# Altium project Back_Expansion_Joystick_8p_16_5mm_15_5mm.PrjPcb
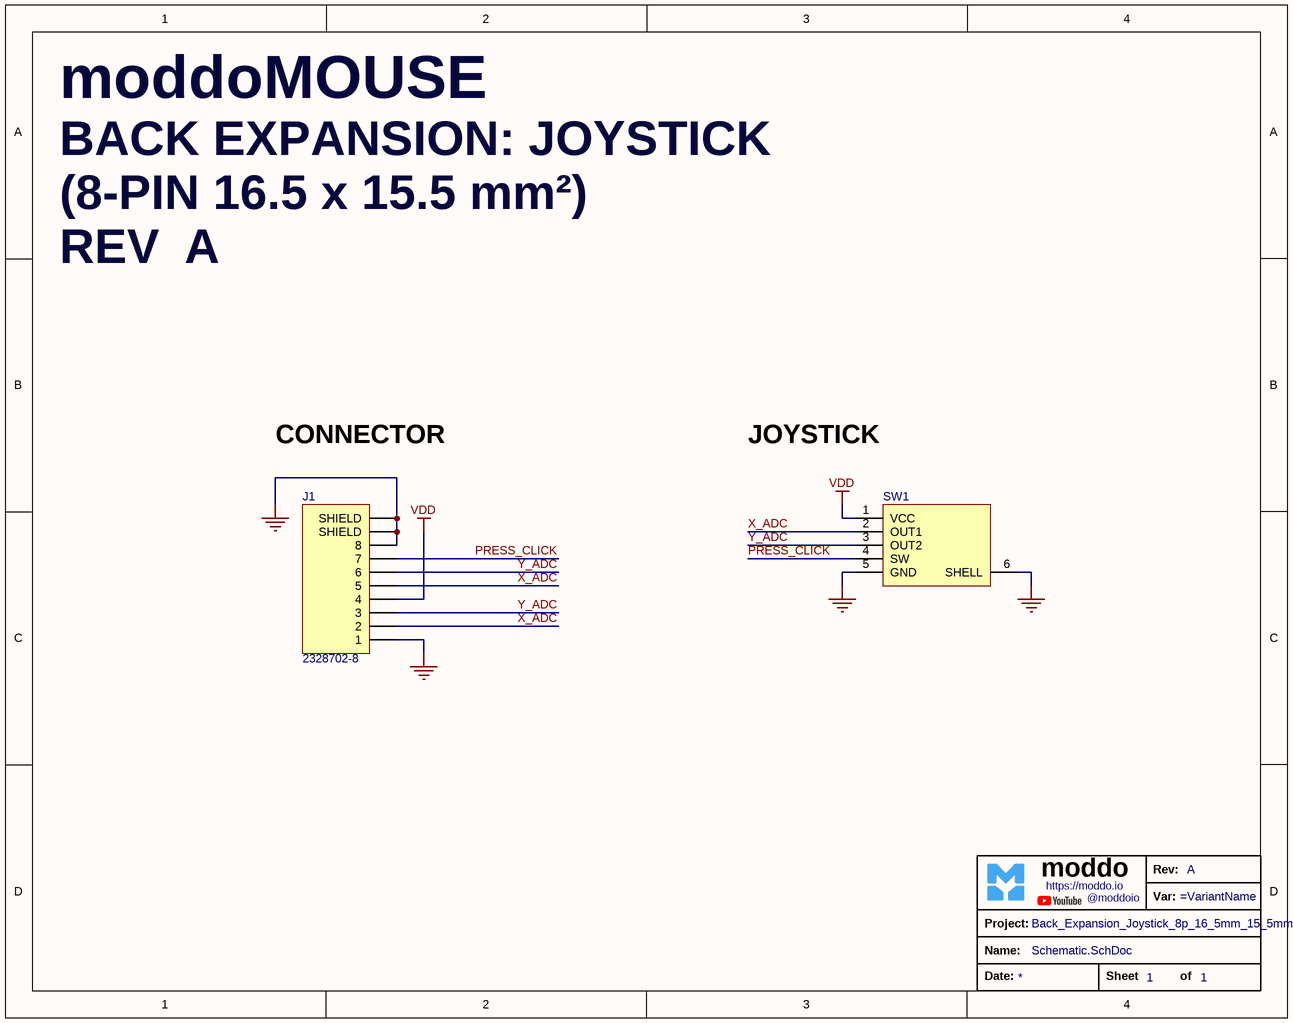
[diagram p0: Schematic.SchDoc]
Revision: A
1 sheet, 3 parts. Net scope: global (net labels, ports and power ports of the same name join across sheets).
Board files: PCB.PcbDoc, PcbPanel.PcbDoc

## Sheet Schematic.SchDoc
size A; SheetNumber: 1; SheetTotal: 1

### Parts
?  TitleBlock_moddo  (value not drawn)  (graphical)
J1  2328702-8  [2328702-8]
SW1  YHE-YG16-001 SH1B166A1  [Joystick_8p_16_5mm_15_5mm]  (value not drawn)

### Nets
GND: J1.1 J1.8 J1.S1(SHIELD) J1.S2(SHIELD) SW1.5(GND) SW1.6(SHELL)
VDD: J1.4 SW1.1(VCC)
PRESS_CLICK: J1.7 SW1.4(SW)
X_ADC: J1.2 J1.5 SW1.2(OUT1)
Y_ADC: J1.3 J1.6 SW1.3(OUT2)

### Notes on the sheet
- moddoMOUSE <https://moddo.io/>
- BACK EXPANSION: JOYSTICK <https://moddo.io/>
- (8-PIN 16.5 x 15.5 mm²) <https://moddo.io/>
- REV
- CONNECTOR
- JOYSTICK
- (in symbol TitleBlock_moddo) Rev:; moddo; https://moddo.io; Var:; @moddoio; Project:; Name:; Date:; Sheet; of

### Library data of the parts
J1 = 2328702-8: FFC/FPC Connector, 8 Contact(s), 1 Row(s), Right Angle, Solder Terminal, Natural Insulator; Manufacturer: TE Connectivity; Actuator Material: Thermoplastic; Actuator Color: Black; Plating: Gold; Number of Positions: 8; Voltage Rating: 50V; Connector System: Wire-to-Board; Gender: Receptacle; Sealable: No (Without); Supplier 1: Arrow Electronics; Manufacturer Part Number: 2328702-8; RoHS: Yes; Category: FFC / FPC; Stock 1: 56000; Pricing 1: 28000=0.0961 (USD); Mounting Technology: Surface Mount; Contact Material: Copper Alloy; Contact Plating: Gold; Housing Material: Thermoplastic; Housing Color: Natural; Min Operating Temperature: -40°C; Max Operating Temperature: 85°C; Packaging: Cut Tape; Termination: Solder; Series: -; Number of Contacts: 8; Number of Rows: 1; Operating Supply Voltage: 50V; Orientation: Right Angle; Length: 6mm; Height: 1mm; Flammability Rating: UL94 V-0; ComponentLink1URL: https://www.te.com/commerce/DocumentDelivery/DDEController?Action=srchrtrv&amp;DocNm=2328702&amp;DocType=Customer+Drawing&amp;DocLang=English&src-supplier=Digikey; ComponentLink1Description: https://www.te.com/commerce/DocumentDelivery/DDEController?Action=srchrtrv&amp;DocNm=2328702&amp;DocType=Customer+Drawing&amp;DocLang=English&src-supplier=Digikey; Supplier Part Number 1: 2328702-8
SW1 = YHE-YG16-001 SH1B166A1: Through Hole Navigation Switches, Joystick RoHS; Manufacturer: YTL; Manufacturer Part Number: YHE-YG16-001 SH1B166A1